# Altium schematic sheet Power.SchDoc
size A4
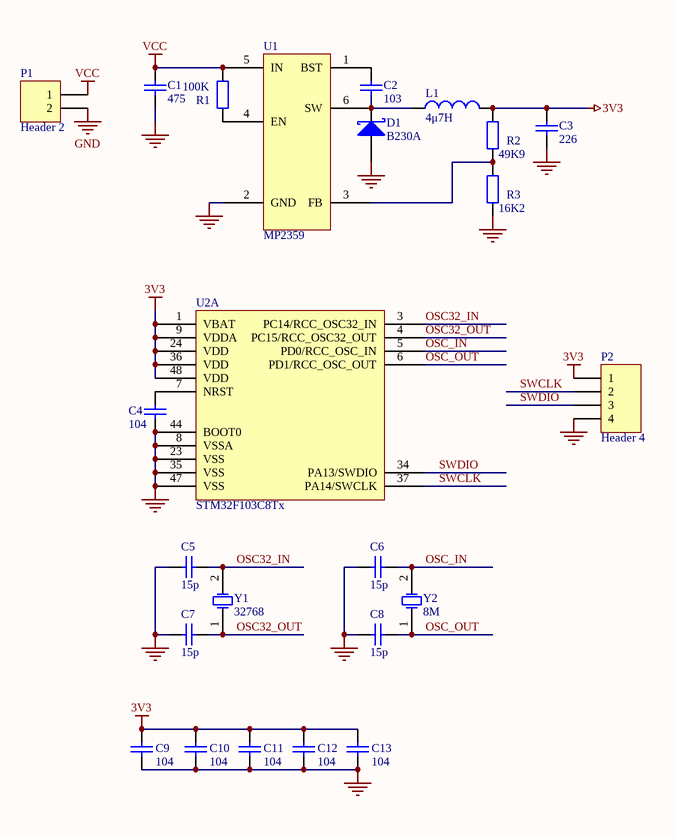
[diagram p0: Power.SchDoc]

## Parts
C1  475  [C1206]
C2  103  [C0603]
C3  226  [C0805]
C4  104  [C0603]
C5  15p  [C0603]
C6  15p  [C0603]
C7  15p  [C0603]
C8  15p  [C0603]
C9  104  [C0603]
C10  104  [C0603]
C11  104  [C0603]
C12  104  [C0603]
C13  104  [C0603]
D1  B230A  [SMA]
L1  value 4μ7H  [L4X4]
P1  Header 2  [XH2P54P2]
P2  Header 4  [SIP4]
R1  value 100K  [R0603]
R2  value 49K9  [R0603]
R3  value 16K2  [R0603]
U1  MP2359  [SOT23-6]
U2  STM32F103C8Tx  [PQFP48]  (part A of 2)
Y1  32768  [FC-135]
Y2  8M  [CY5032]

## Nets
3V3: C3.2 C9.2 C10.2 C11.2 C12.2 C13.2 L1.2 P2.1 R2.1 U2.1(VBAT) U2.9(VDDA) U2.24(VDD) U2.36(VDD) U2.48(VDD)
GND: C1.1 C3.1 C4.1 C5.2 C6.2 C7.2 C8.2 C9.1 C10.1 C11.1 C12.1 C13.1 D1.1(A) P1.2 P2.4 R3.2 U1.2(GND) U2.8(VSSA) U2.23(VSS) U2.35(VSS) U2.44(BOOT0) U2.47(VSS)
VCC: C1.2 P1.1 R1.1 U1.5(IN)
OSC32_IN: C5.1 U2.3(PC14/RCC_OSC32_IN) Y1.2(OSC2)
OSC32_OUT: C7.1 U2.4(PC15/RCC_OSC32_OUT) Y1.1(OSC1)
OSC_IN: C6.1 U2.5(PD0/RCC_OSC_IN) Y2.2(OSC2)
OSC_OUT: C8.1 U2.6(PD1/RCC_OSC_OUT) Y2.1(OSC1)
SWCLK: P2.2 U2.37(PA14/SWCLK)
SWDIO: P2.3 U2.34(PA13/SWDIO)
NetC2_1: C2.1 D1.2(K) L1.1 U1.6(SW)
NetC2_2: C2.2 U1.1(BST)
NetC4_2: C4.2 U2.7(NRST)
NetR1_2: R1.2 U1.4(EN)
NetR2_2: R2.2 R3.1 U1.3(FB)

## Library data of the parts
C1-C13 = Cap: Capacitor; Published: 8-Jun-2000; LatestRevisionDate: 17-Jul-2002; LatestRevisionNote: Re-released for DXP Platform.; PackageReference: RAD-0.3; Publisher: Altium Limited; PackageDescription: Radial Cap, Thru-Hole; 2 Leads; 0.3 in Pin Spacing
D1 = Diode BAS70: Silicon AF Schottky Diode for High-Speed Switching; Note: Pin 2 is not connected and not drawn.; Published: 21-Mar-2003; LatestRevisionDate: 29-May-2009; LatestRevisionNote: IPC-7351 Footprint Added.; DatasheetVersion: Oct-1999; PackageVersion: Sep-2001; PackageReference: SOT-23; Publisher: Altium Limited; PackageDescription: 3-Pin SOT-23 Package 0.95 mm Pitch, 2.5 mm Lead Span; ComponentLink1Description: Manufacturer Link; ComponentLink1URL: http://www.infineon.com/; ComponentLink2Description: Datasheet; ComponentLink2URL: http://www.infineon.com/upload/Document/cmc_upload/documents/009/382/bas40_bas140series_1.pdf
L1 = Inductor: Code_IEC: 1005; Published: 8-Jun-2000; LatestRevisionDate: 29-May-2009; LatestRevisionNote: IPC-7351 Footprint Added.; PackageReference: 0402-A; Publisher: Altium Limited; PackageDescription: Chip Inductor; Code_JEITA: 0402
P1 = Header 2H: Header, 2-Pin, Right Angle; LatestRevisionDate: 17-Jul-2002; LatestRevisionNote: Re-released for DXP Platform.; Publisher: Altium Limited
P2 = Header 4: Header, 4-Pin; LatestRevisionDate: 17-Jul-2002; LatestRevisionNote: Re-released for DXP Platform.; Publisher: Altium Limited
R1-R3 = Res2: Resistor; Published: 8-Jun-2000; LatestRevisionDate: 17-Jul-2002; LatestRevisionNote: Re-released for DXP Platform.; PackageReference: AXIAL-0.4; Publisher: Altium Limited; PackageDescription: Axial Device, Thru-Hole; 2 Leads; 0.4 in Pin Spacing
Y1 Y2 = XTAL: Crystal Oscillator; Published: 8-Jun-2000; LatestRevisionDate: 17-Jul-2002; LatestRevisionNote: Re-released for DXP Platform.; PackageReference: R38; Publisher: Altium Limited; PackageDescription: Crystal, Thru-Hole; 2 Leads; Body 3.1 x 8.2 mm (Dia.xH)